# EAGLE schematic CapstoneControllerBoard (EAGLE 9.2.2)
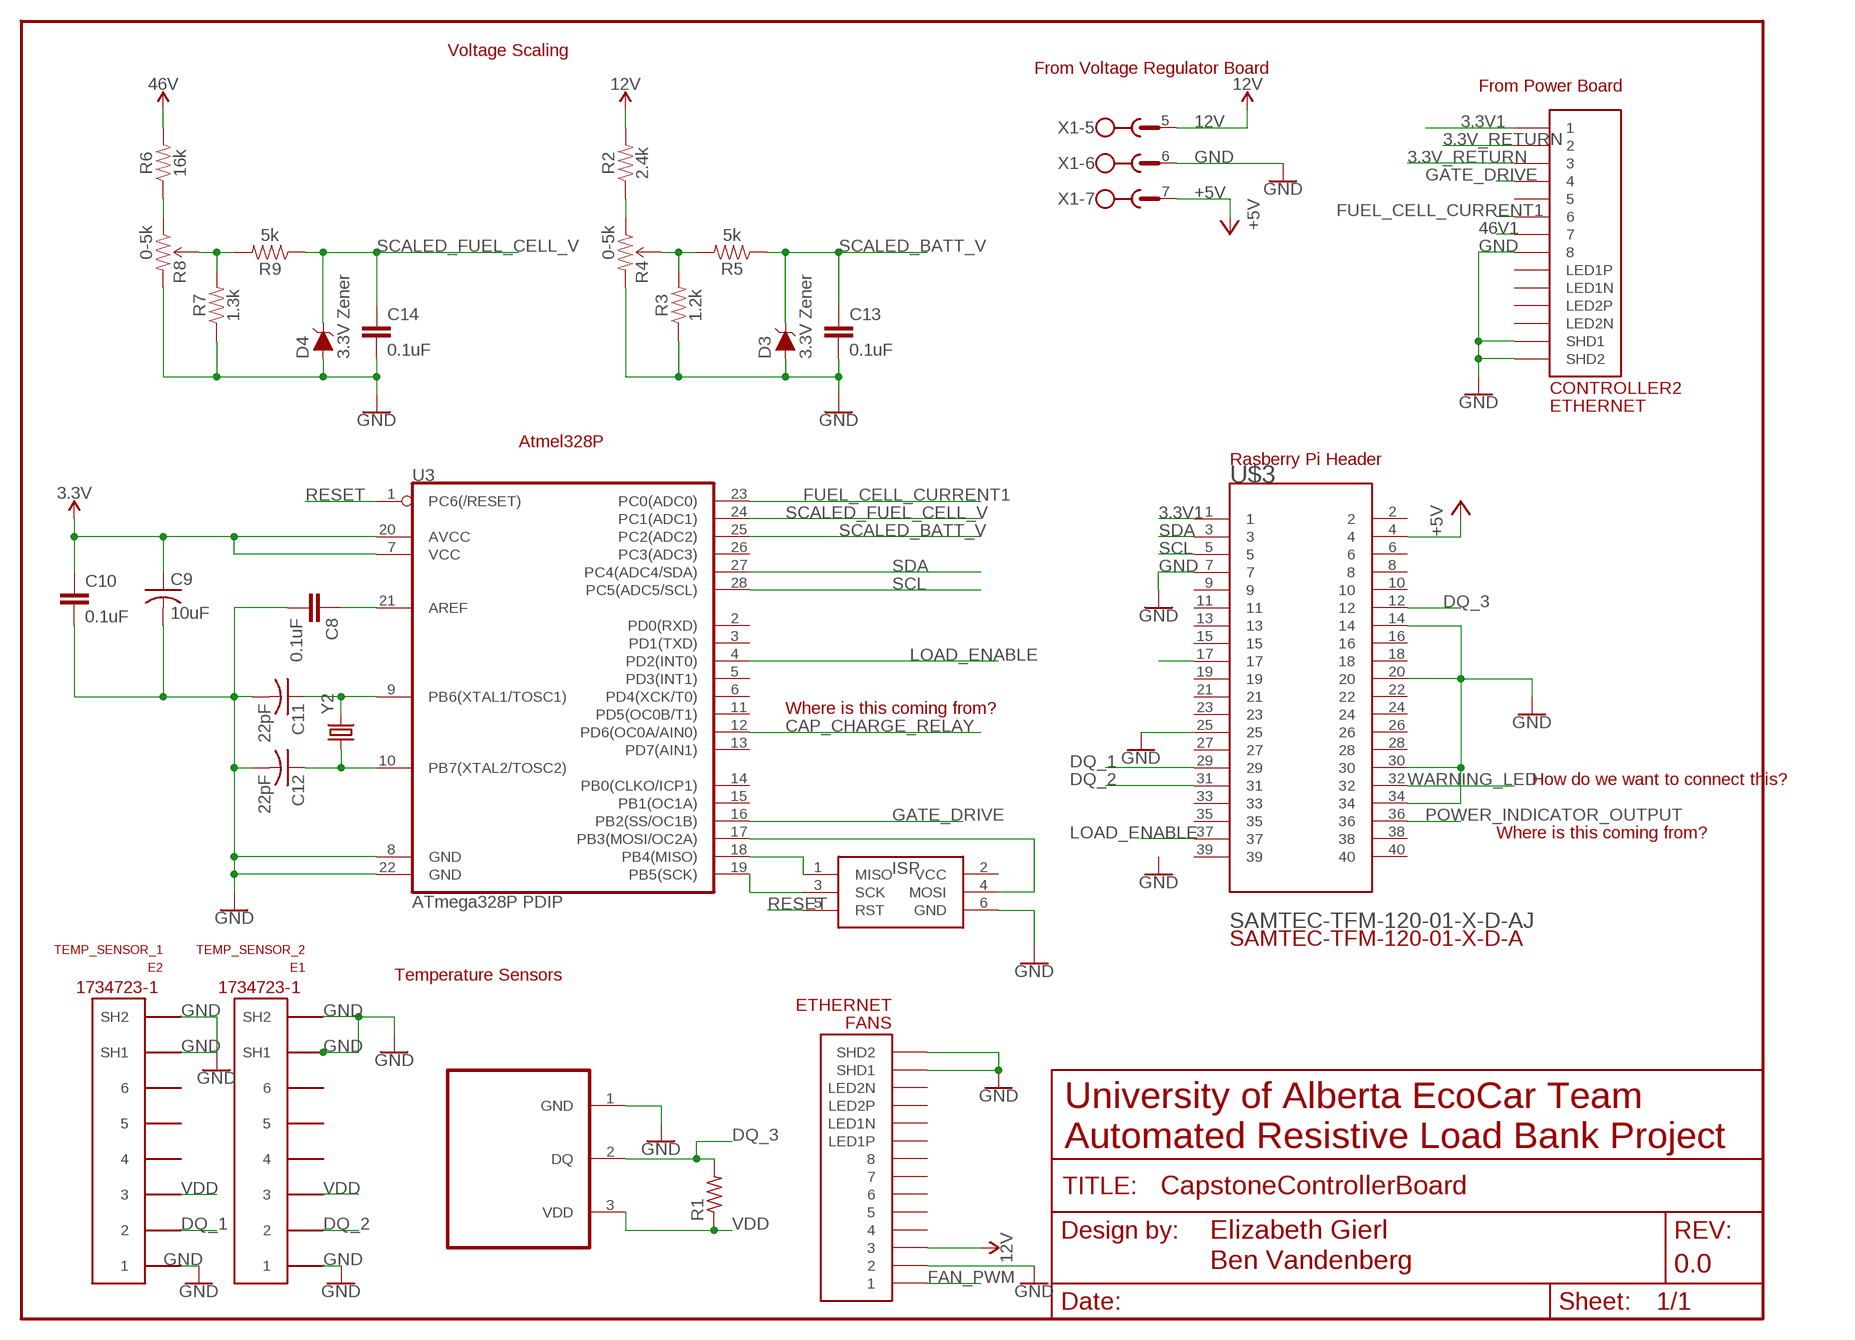
[diagram p0: schematic, sheet 1]

## Parts
C8  0.1uF  1.0UF-0805-25V-(+80/-20%)  [0805]
C9  10uF  C-USC0603  [C0603]
C10  0.1uF  1.0UF-0805-25V-(+80/-20%)  [0805]
C11  22pF  C-USC0603  [C0603]
C12  22pF  C-USC0603  [C0603]
C13  0.1uF  1.0UF-0805-25V-(+80/-20%)  [0805]
C14  0.1uF  1.0UF-0805-25V-(+80/-20%)  [0805]
CONTROLLER2  ETHERNET  [A122645-ND]
D3  3.3V Zener  SMALL_DIODE  [DO41-7.6]
D4  3.3V Zener  SMALL_DIODE  [DO41-7.6]
E1  TEMP_SENSOR_2  5555140-6  [1734723-1_RJ11]
E2  TEMP_SENSOR_1  5555140-6  [1734723-1_RJ11]
FANS  ETHERNET  [A122645-ND]
FRAME2  FRAME-LETTERNO_PACKAGE  [DUMMY]
ISP  AVRISP-BOX  [AVRISP-BOX]
R1  R-US_R0805  [R0805]
R2  2.4k  0.3OHM-0805-1/8W-1%  [0805]
R3  1.2k  0.3OHM-0805-1/8W-1%  [0805]
R4  0-5k  CT6EP502_TRIM_POT  [TRIM_POT]
R5  5k  0.3OHM-0805-1/8W-1%  [0805]
R6  16k  0.3OHM-0805-1/8W-1%  [0805]
R7  1.3k  0.3OHM-0805-1/8W-1%  [0805]
R8  0-5k  CT6EP502_TRIM_POT  [TRIM_POT]
R9  5k  0.3OHM-0805-1/8W-1%  [0805]
U3  ATmega328P PDIP  ATMEGA328P_PDIP  [PDIP-T28]
U$2  DS18B  [TO92]
U$3  SAMTEC-TFM-120-01-X-D-AJ  [SAMTEC-TFM-120-01-X-D-A]
X1  MSTBA8  [MSTBA8]
Y2  CRYSTALHC49US  [HC49US]

## Nets
3.3V: C9.1 C10.1 U3.7(VCC) U3.20(AVCC)
3.3V1: CONTROLLER2.P$1 U$3.1
3.3V_RETURN: CONTROLLER2.P$2 CONTROLLER2.P$3
12V: FANS.P$3 R2.2 X1.5
46V: R6.2
46V1: CONTROLLER2.P$7
+5V: U$3.4 X1.7
CAP_CHARGE_RELAY: U3.12(PD6(OC0A/AIN0))
DQ_1: E2.2 U$3.29
DQ_2: E1.2 U$3.31
DQ_3: R1.2 U$2.2(DQ) U$3.12
FAN_PWM: FANS.P$1
FUEL_CELL_CURRENT1: CONTROLLER2.P$6 U3.23(PC0(ADC0))
GATE_DRIVE: CONTROLLER2.P$4 U3.16(PB2(SS/OC1B))
GND: C8.2 C9.2 C10.2 C11.2 C12.2 C13.2 C14.2 CONTROLLER2.P$8 CONTROLLER2.P$13(SHD1) CONTROLLER2.P$14(SHD2) D3.A D4.A E1.1 E1.SH1 E1.SH2 E2.1 E2.SH1 E2.SH2 FANS.P$2 FANS.P$13(SHD1) FANS.P$14(SHD2) ISP.6(GND) R3.1 R4.3(CW) R7.1 R8.3(CW) U3.8(GND) U3.22(GND) U$2.1(GND) U$3.7 U$3.14 U$3.20 U$3.25 U$3.30 U$3.34 X1.6
LOAD_ENABLE: U3.4(PD2(INT0)) U$3.37
N$1: C8.1 U3.21(AREF)
N$2: ISP.1(MISO) U3.18(PB4(MISO))
N$3: ISP.3(SCK) U3.19(PB5(SCK))
N$4: U$3.17
N$7: R2.1 R4.1(CCW)
N$10: R6.1 R8.1(CCW)
N$11: R3.2 R4.2(WIPER) R5.2
N$12: ISP.4(MOSI) U3.17(PB3(MOSI/OC2A))
N$13: C11.1 U3.9(PB6(XTAL1/TOSC1)) Y2.2
N$14: C12.1 U3.10(PB7(XTAL2/TOSC2)) Y2.1
N$15: R7.2 R8.2(WIPER) R9.2
POWER_INDICATOR_OUTPUT: U$3.36
RESET: ISP.5(RST) U3.1(PC6(/RESET))
SCALED_BATT_V: C13.1 D3.C R5.1 U3.25(PC2(ADC2))
SCALED_FUEL_CELL_V: C14.1 D4.C R9.1 U3.24(PC1(ADC1))
SCL: U3.28(PC5(ADC5/SCL)) U$3.5
SDA: U3.27(PC4(ADC4/SDA)) U$3.3
VDD: E1.3 E2.3 R1.1 U$2.3(VDD)
WARNING_LED: U$3.32
Unconnected: CONTROLLER2.P$5 CONTROLLER2.P$9(LED1N) CONTROLLER2.P$10(LED1P) CONTROLLER2.P$11(LED2N) CONTROLLER2.P$12(LED2P) E1.4 E1.5 E1.6 E2.4 E2.5 E2.6 FANS.P$4 FANS.P$5 FANS.P$6 FANS.P$7 FANS.P$8 FANS.P$9(LED1N) FANS.P$10(LED1P) FANS.P$11(LED2N) FANS.P$12(LED2P) U3.2(PD0(RXD)) U3.3(PD1(TXD)) U3.5(PD3(INT1)) U3.6(PD4(XCK/T0)) U3.11(PD5(OC0B/T1)) U3.13(PD7(AIN1)) U3.14(PB0(CLKO/ICP1)) U3.15(PB1(OC1A)) U3.26(PC3(ADC3)) U$3.2 U$3.6 U$3.8 U$3.9 U$3.10 U$3.11 U$3.13 U$3.15 U$3.16 U$3.18 U$3.19 U$3.21 U$3.22 U$3.23 U$3.24 U$3.26 U$3.27 U$3.28 U$3.33 U$3.35 U$3.38 U$3.39 U$3.40 X1.1 X1.2 X1.3 X1.4 X1.8

## Notes on the sheet
- Voltage Scaling
- From Voltage Regulator Board
- From Power Board
- Atmel328P
- Rasberry Pi Header
- Where is this coming from?
- How do we want to connect this?
- Where is this coming from?
- Temperature Sensors
- University of Alberta EcoCar Team
  Automated Resistive Load Bank Project
- Elizabeth Gierl

## Power pins joined to a net without a drawn wire
VCC: ISP.2(VCC)

## Library data of the parts
C8 C10 C13 C14 = SparkFun-Capacitors:1.0UF: 1µF ceramic capacitors A capacitor is a passive two-terminal electrical component used to store electrical energy temporarily in an electric field.; PROD_ID: CAP-11625; VALUE: 1.0uF
C9 C11 C12 = adafruit:C-US: CAPACITOR, American symbol
CONTROLLER2 FANS = ETHERNET-3:ETHERNET: Ethernet port with 2 leds. digikey number A122645-ND
D3 D4 = CustomLibrary:SMALL_DIODE
E1 E2 = 5555140-6 RJ11:5555140-6
FRAME2 = SparkFun-Aesthetics:FRAME-LETTER: Schematic Frame - Letter Standard 8.5x11 US Letter frame; DESIGNER: Ben Vandenberg; REV: 0.0; VERSION: v01
ISP = adafruit:AVRISP: AVR ISP HEADER Standard 6 pin header for AVR programming
R1 = rcl:R-US_: RESISTOR, American symbol; SPICEPREFIX: R
R2 R3 R5-R7 R9 = SparkFun-Resistors:0.3OHM: 0.3Ω resistor A resistor is a passive two-terminal electrical component that implements electrical resistance as a circuit element. Resistors act to reduce current flow, and, at the same time, act to lower voltage levels within circuits. - Wikipedia; PROD_ID: RES-11622; VALUE: 0.3
R4 R8 = CustomLibrary:CT6EP502_TRIM_POT: Trimmer Potentiometer Nidec Copal CT6EP502 5k 0.5W
U3 = CustomLibrary:ATMEGA328P_PDIP
U$2 = temperatureboardElizabeth:DS18B
U$3 = SAMTEC-TFM-120-01-X-D-A:SAMTEC-TFM-120-01-X-D-A; AVAILABILITY: Unavailable; DESCRIPTION: HEADER, 1.27MM, 2X20POS; Series: TFM; Pitch Spacing: 1.27mm; No. of Rows: 2; No. of; MF: Samtec Inc.; MP: TFM-120-01-S-D-A; PACKAGE: None; PRICE: None
X1 = con-phoenix-508:MSTBA8: PHOENIX; MF: FARNELL; MPN: 1757307; OC_FARNELL: 3705225; OC_NEWARK: 71C4166
Y2 = SparkFun-FreqCtrl:CRYSTAL: Various standard crystals. Proven footprints.